# EasyEDA Pro project ProPrj_Плата захисту аккумулятора_2026-06-05.epro

# Schematic Schematic1
Board Name: Board1; Create Date: 2026-03-03; Page Name: P1; Project Name: Плата захисту аккумулятора; Schematic Name: Schematic1; Update Date: 2026-03-03; Company: EasyEDA.com; Page Size: A4; Version: V1.0
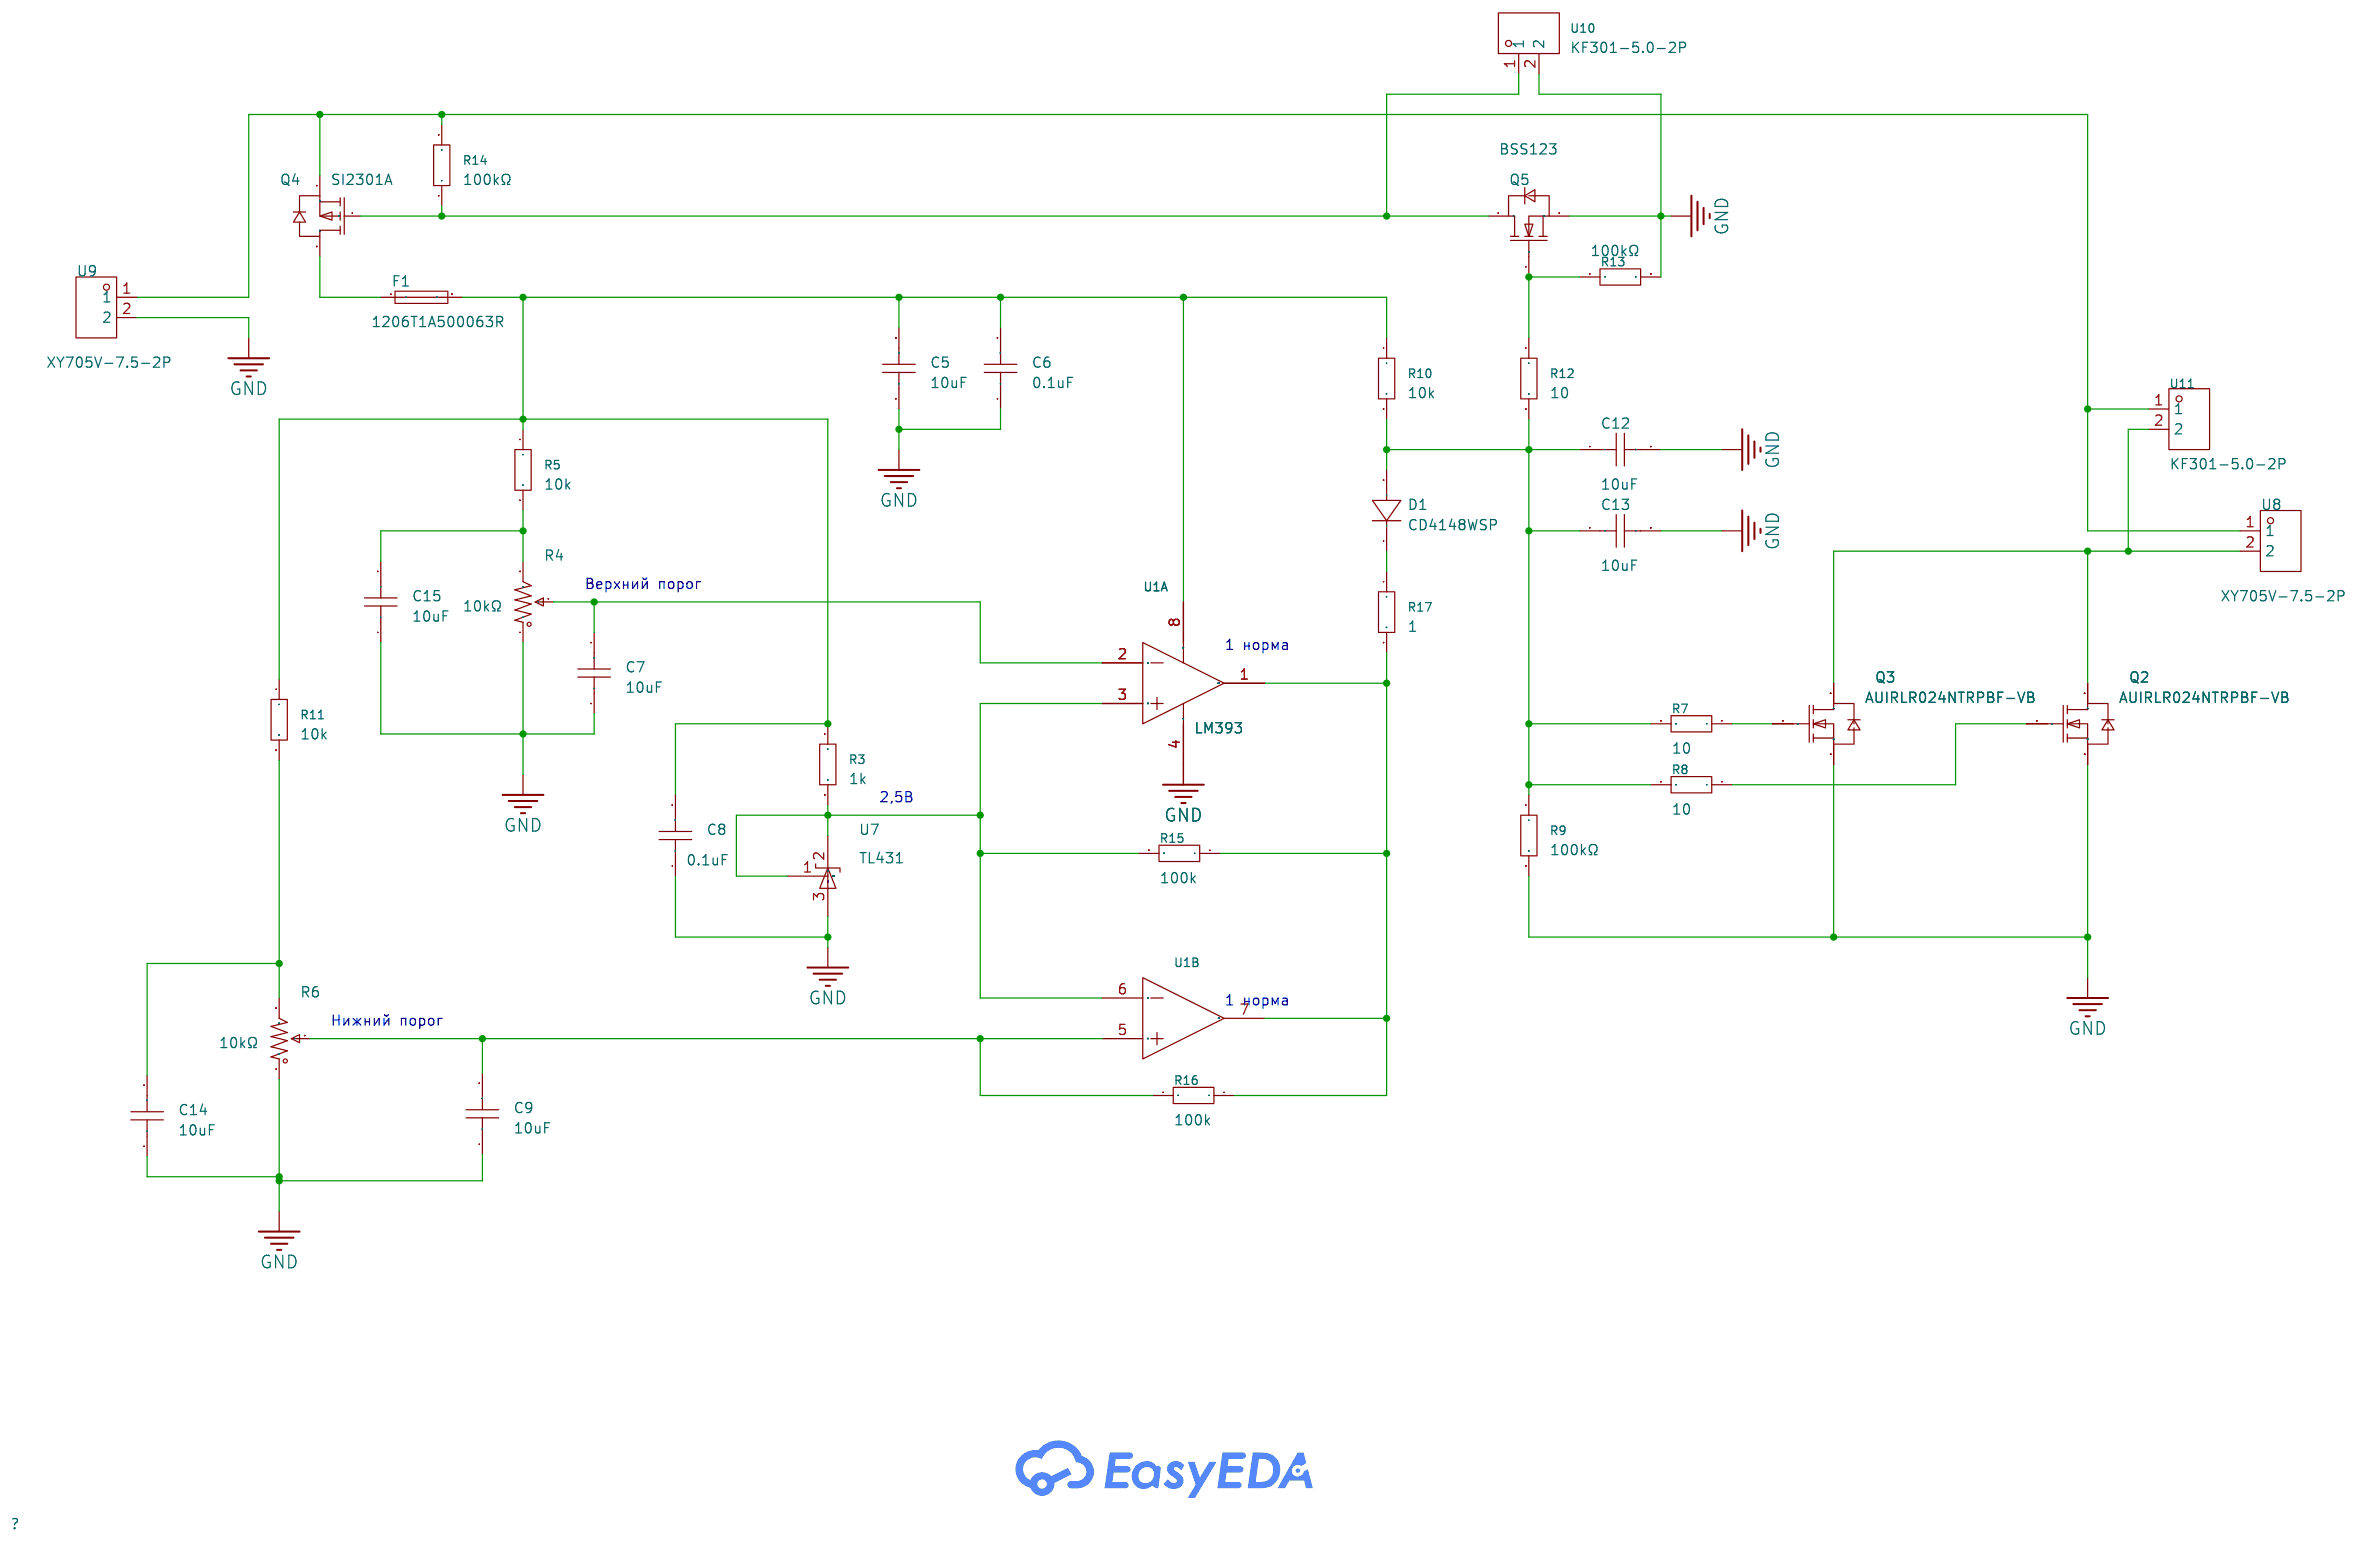
[diagram p0: schematic sheet]

## Parts
C5  10uF  [C1206]
C6  0.1uF  [C1206]
C7  10uF  [C1206]
C8  0.1uF  [C1206]
C9  10uF  [C1206]
C12  10uF  [C1206]
C13  10uF  [C1206]
C14  10uF  [C1206]
C15  10uF  [C1206]
D1  CD4148WSP  [D0805-RD]
F1  1206T1A500063R  [F1206]
Q2  AUIRLR024NTRPBF-VB  [TO-252-2_L6.5-W6.1-P4.56-LS9.9-BR-CW-1]
Q3  AUIRLR024NTRPBF-VB  [TO-252-2_L6.5-W6.1-P4.56-LS9.9-BR-CW-1]
Q4  SI2301A  [SOT-23-3_L2.9-W1.3-P1.90-LS2.4-BR]
Q5  BSS123  [SOT-23-3_L3.0-W1.7-P0.95-LS2.9-BR]
R3  1k  [R0805]
R4  10kΩ  [RES-ADJ-TH_3P-L10.0-W10.0-P2.50-L]
R5  10k  [R0805]
R6  10kΩ  [RES-ADJ-TH_3P-L10.0-W10.0-P2.50-L]
R7  10  [R0805]
R8  10  [R0805]
R9  100kΩ  [R0805]
R10  10k  [R0805]
R11  10k  [R0805]
R12  10  [R0805]
R13  100kΩ  [R0805]
R14  100kΩ  [R0805]
R15  100k  [R0805]
R16  100k  [R0805]
R17  1  [R0805]
U1  LM393  [SOP-8_L4.9-W3.9-P1.27-LS6.0-BL]  (sections 1,2)
U7  TL431  [SOT-23-3_L2.9-W1.3-P0.95-LS2.4-BR]
U8  XY705V-7.5-2P  [CONN-TH_XY705V-7.5-2P]
U9  XY705V-7.5-2P  [CONN-TH_XY705V-7.5-2P]
U10  KF301-5.0-2P  [CONN-TH_P5.00_KF301-5.0-2P]
U11  KF301-5.0-2P  [CONN-TH_P5.00_KF301-5.0-2P]

## Library data of the parts
C5-C9 C14 C15 = 1206B106K500NT: Capacitance:10uF Tolerance:±10% Tolerance:±10% Voltage Rating:50V Temperature Coefficient:X7R; LCSC Part Name: 10uF ±10% 50V; Supplier Part: C303950; Manufacturer: FH(风华); Supplier Footprint: 1206; JLCPCB Part Class: Extended Part; Datasheet: https://item.szlcsc.com/datasheet/1206B106K500NT/288017.html; Supplier: LCSC; Tolerance: ±10%; Voltage Rating: 50V; Temperature Coefficient: X7R
C12 C13 = C1206X106K025T: Capacitance: Tolerance:±10% Tolerance:±10% Voltage Rated: Temperature Coefficient:; LCSC Part Name: 10uF ±10% 25V; Supplier Part: C106027; Manufacturer: IHHEC(禾伸堂); Supplier Footprint: 1206; JLCPCB Part Class: Extended Part; Datasheet: https://atta.szlcsc.com/upload/public/pdf/source/20190313/C374174_331C86E4A68CC9C732DA87186AAF7F8A.pdf; Supplier: LCSC; Tolerance: ±10%
D1 = CD4148WSP_C30584799: Diode Configuration:Independent Voltage - Forward(Vf@If):1.25V@100mA Voltage - DC Reverse(Vr):75V Current - Rectified:150mA Pd - Power Dissipation:200mW Reverse Leakage Current (Ir):5uA@75V Reverse Recovery Time (trr):4ns Operating Junction Temperature Ra; LCSC Part Name: 75V 150mA; Supplier Part: C30584799; Manufacturer: YONGYUTAI(永裕泰); Supplier Footprint: 0805; JLCPCB Part Class: Extended Part; Datasheet: https://item.szlcsc.com/datasheet/CD4148WSP/32319011.html; Supplier: LCSC; Diode Configuration: Independent; Voltage - Forward(Vf@If): 1.25V@100mA; Voltage - DC Reverse(Vr): 75V; Current - Rectified: 150mA; Pd - Power Dissipation: 200mW; Reverse Leakage Current (Ir): 5uA@75V; Reverse Recovery Time (trr): 4ns; Operating Junction Temperature Range: -55℃~+150℃@(Tj); Non-Repetitive Peak Forward Surge Current: 1A
F1 = 1206T1A500063R: Type:Surface Mount Fuse Current Rating:1.5A Voltage Rating (DC):63V Operating Temperature:-55℃~+150℃ Operating Temperature:-55℃~+150℃ Melting I2t:0.583 Interrupt Rating:50A Length:3.2mm Width:1.6mm; LCSC Part Name: 贴片式陶瓷保险丝; Supplier Part: C354894; Manufacturer: WALTER(华德); Supplier Footprint: 1206; JLCPCB Part Class: Extended Part; Datasheet: https://item.szlcsc.com/datasheet/1206T1A500063R/330419.html; Supplier: LCSC; Type: Surface Mount Fuse; Current Rating: 1.5A; Voltage Rating (DC): 63V; Operating Temperature: -55℃~+150℃; Melting I2t: 0.583; Interrupt Rating: 50A; Length: 3.2mm; Width: 1.6mm
Q2 Q3 = AUIRLR024NTRPBF-VB: Number:1 N-Channel Drain to Source Voltage:60V Current - Continuous Drain(Id):18A RDS(on):73mΩ@10V Pd - Power Dissipation:- Gate Threshold Voltage (Vgs(th)):- Input Capacitance(Ciss):660pF@30V Reverse Transfer Capacitance (Crss@Vds):40pF@30V; LCSC Part Name: 1个N沟道 耐压:60V 电流:18A; Supplier Part: C7568984; Manufacturer: VBsemi(微碧半导体); Supplier Footprint: TO-252; JLCPCB Part Class: Extended Part; Datasheet: https://item.szlcsc.com/datasheet/AUIRLR024NTRPBF-VB/8683237.html; Supplier: LCSC; Number: 1 N-Channel; Drain to Source Voltage: 60V; Current - Continuous Drain(Id): 18A; RDS(on): 73mΩ@10V; Input Capacitance(Ciss): 660pF@30V; Reverse Transfer Capacitance (Crss@Vds): 40pF@30V
Q4 = SI2301A_C49010227: Drain to Source Voltage:20V Current - Continuous Drain(Id):2.5A RDS(on):85mΩ@4.5V Pd - Power Dissipation:700mW Gate Threshold Voltage (Vgs(th)):620mV@250uA Gate Charge(Qg):2.9nC@4.5V Input Capacitance(Ciss):248pF Reverse Transfer Capacitance (Crss@Vds):31; LCSC Part Name: 无 耐压:20V 电流:2.5A; Supplier Part: C49010227; Manufacturer: YONGYUTAI(永裕泰); Supplier Footprint: SOT-23; JLCPCB Part Class: Extended Part; Datasheet: https://item.szlcsc.com/datasheet/SI2301A/51366751.html; Supplier: LCSC; Drain to Source Voltage: 20V; Current - Continuous Drain(Id): 2.5A; RDS(on): 85mΩ@4.5V; Pd - Power Dissipation: 700mW; Gate Threshold Voltage (Vgs(th)): 620mV@250uA; Gate Charge(Qg): 2.9nC@4.5V; Input Capacitance(Ciss): 248pF; Reverse Transfer Capacitance (Crss@Vds): 31pF; Output Capacitance(Coss): 42pF
Q5 = BSS123_1: Number:1 N-channel Drain to Source Voltage:100V Current - Continuous Drain(Id):290mA RDS(on):2.7Ω@10V；2.95Ω@4.5V Pd - Power Dissipation:350mW Gate Threshold Voltage (Vgs(th)):1.8V Input Capacitance(Ciss):29pF Reverse Transfer Capacitance (Crss@Vds):2pF Op; LCSC Part Name: N沟道 耐压:100V 电流:290mA; Supplier Part: C39832210; Manufacturer: ElecSuper(静芯); Supplier Footprint: SOT-23; Datasheet: https://item.szlcsc.com/datasheet/BSS123/41557676.html; Supplier: LCSC; Number: 1 N-channel; Drain to Source Voltage: 100V; Current - Continuous Drain(Id): 290mA; RDS(on): 2.7Ω@10V；2.95Ω@4.5V; Pd - Power Dissipation: 350mW; Gate Threshold Voltage (Vgs(th)): 1.8V; Input Capacitance(Ciss): 29pF; Reverse Transfer Capacitance (Crss@Vds): 2pF; Operating Temperature: -55℃~+150℃; Type: N-Channel; Output Capacitance(Coss): 2.8pF
R3 R5 R7-R17 = RMC0805100K5%N: Type:Thick Film Resistor Resistance:100kΩ Tolerance:±5% Tolerance:±5% Power(Watts):125mW Voltage-Supply(Max):150V Temperature Coefficient:±100ppm/℃ Temperature Coefficient:±100ppm/℃ Operating Temperature:-55℃~+155℃ Operating Temperature:-55℃~+155℃; LCSC Part Name: 厚膜电阻 100kΩ ±5% 125mW; Supplier Part: C269722; Manufacturer: Tyohm(幸亚电阻); Supplier Footprint: 0805; JLCPCB Part Class: Extended Part; Datasheet: https://item.szlcsc.com/datasheet/RMC0805100K5%2525N/259162.html; Supplier: LCSC; Type: Thick Film Resistor; Tolerance: ±5%; Power(Watts): 125mW; Voltage-Supply(Max): 150V; Temperature Coefficient: ±100ppm/℃; Operating Temperature: -55℃~+155℃
R4 R6 = 3296W-1-103_C118954: Resistance:10kΩ Tolerance:±10% Tolerance:±10% Power(Watts):500mW Temperature Coefficient:±250ppm/℃ Temperature Coefficient:±250ppm/℃ Number of Turns:30; LCSC Part Name: 10kΩ ±10%; Supplier Part: C118954; Manufacturer: BOCHEN(博晨); Manufacturer Part: 3296W-1-103; Supplier Footprint: 插件-3P,9.5x4.9mm; JLCPCB Part Class: Extended Part; Datasheet: https://item.szlcsc.com/datasheet/3296W-1-103/120223.html; Supplier: LCSC; Tolerance: ±10%; Power(Watts): 500mW; Temperature Coefficient: ±250ppm/℃; Number of Turns: 30
U1 = LM393_C5252905: Number of Channels:2 Vos - Input Offset Voltage:1mV Ib - Input Bias Current:100nA Common Mode Rejection Ratio(CMRR):- Output Type:- Output Type:- Quiescent Current:600uA Operating Temperature:0℃~+70℃ Operating Temperature:0℃~+70℃; LCSC Part Name: 单电源电压范围:2V~32V LM393; Supplier Part: C5252905; Manufacturer: MSKSEMI(美森科); Supplier Footprint: SOP-8; JLCPCB Part Class: Extended Part; Datasheet: https://item.szlcsc.com/datasheet/LM393/5971206.html; Supplier: LCSC; Number of Channels: 2; Vos - Input Offset Voltage: 1mV; Ib - Input Bias Current: 100nA; Quiescent Current: 600uA; Operating Temperature: 0℃~+70℃
U7 = TL431_C49195703: Output Type:Adjustable Voltage - Supply:2.5V~40V Voltage - Supply:2.5V~40V Output Voltage:2.5V~40V Output Voltage:2.5V~40V Output Current:100mA Tolerance:±0.5% Tolerance:±0.5% Temperature Coefficient:50ppm/℃ Minimum Cathode Current for Regulation:50uA Ope; LCSC Part Name: 2.5V~40V 50ppm/℃; Supplier Part: C49195703; Manufacturer: KUU; Supplier Footprint: SOT-23; JLCPCB Part Class: Extended Part; Datasheet: https://item.szlcsc.com/datasheet/TL431/51597051.html; Supplier: LCSC; Output Type: Adjustable; Voltage - Supply: 2.5V~40V; Output Voltage: 2.5V~40V; Output Current: 100mA; Tolerance: ±0.5%; Temperature Coefficient: 50ppm/℃; Minimum Cathode Current for Regulation: 50uA; Operating Temperature: -40℃~+125℃
U8 U9 = XY705V-7.5-2P: Number of Positions or Pins:1x2P Pitch:7.5mm Color:Black Mounting Type:Through Hole Number of Pins:2P Number of Rows:1 Number of PINs Per Row:2 Screw Specification:M2.5 Current Rating:15A Voltage Rating (Max):300V Wire Gauge - AWG:14~22 Wire Gauge - mm2:2; LCSC Part Name: 1x2P 7.5mm 直插 排数:1 每排P数:2; Supplier Part: C557657; Manufacturer: XINLAIYA(新莱亚); Supplier Footprint: 插件,P=7.5mm; JLCPCB Part Class: Extended Part; Datasheet: https://item.szlcsc.com/datasheet/XY705V-7.5-2P/581020.html; Supplier: LCSC; Number of Positions or Pins: 1x2P; Pitch: 7.5mm; Color: Black; Mounting Type: Through Hole; Number of Pins: 2P; Number of Rows: 1; Number of PINs Per Row: 2; Screw Specification: M2.5; Current Rating: 15A; Voltage Rating (Max): 300V; Wire Gauge - AWG: 14~22; Wire Gauge - mm2: 2.5
U10 U11 = KF301-5.0-2P: Number of Positions or Pins:1x2P Pitch:5mm Color:Blue Mounting Type:Through Hole Number of Pins:2P Number of Rows:1 Number of PINs Per Row:2 Current Rating:17A Voltage Rating (Max):250V Wire Gauge - AWG:14~22 Wire Gauge - mm2:1.5 Wire Gauge - mm2:1.5 Oper; LCSC Part Name: 1x2P 5mm 直插 排数:1 每排P数:2; Supplier Part: C474881; Manufacturer: KEFA(科发); Supplier Footprint: 插件,P=5mm; JLCPCB Part Class: Extended Part; Datasheet: https://item.szlcsc.com/datasheet/KF301-5.0-2P/481499.html; Supplier: LCSC; Number of Positions or Pins: 1x2P; Pitch: 5mm; Color: Blue; Mounting Type: Through Hole; Number of Pins: 2P; Number of Rows: 1; Number of PINs Per Row: 2; Current Rating: 17A; Voltage Rating (Max): 250V; Wire Gauge - AWG: 14~22; Wire Gauge - mm2: 1.5; Operating Temperature: -30℃~+120℃

## Nets
GND: C5.1 C6.1 C7.1 C8.1 C9.1 C12.2 C13.2 C14.1 C15.1 Q2.3(S) Q3.3(S) Q5.2(S) R4.1 R6.1 R9.2 R13.2 U1.4(VEE) U7.3(ANODE) U9.2 U10.2
$1N2103: C15.2 R4.3 R5.2
$1N2162: C7.2 R4.2 U1.2(1IN-)
$1N2211: R3.2 R15.2 U1.3(1IN+) U1.6(2IN-) U7.1(REFERENCE) U7.2(CATHODE)
$1N2373: C9.2 R6.2 R16.2 U1.5(2IN+)
$1N2587: Q2.2(D) Q3.2(D) U8.2 U11.2
$1N2867: Q2.1(G) R8.1
$1N2876: Q3.1(G) R7.1
$1N3466: C14.2 R6.3 R11.2
$1N4334: F1.1 Q4.3(D)
$1N4367: Q4.2(S) R14.2 U8.1 U9.1 U11.1
$1N4444: Q4.1(G) Q5.3(D) R14.1 U10.1
$1N4584: Q5.1(G) R12.1 R13.1
$1N5209: C5.2 C6.2 C8.2 F1.2 R3.1 R5.1 R10.1 R11.1 U1.8(VCC)
$1N5413: C12.1 C13.1 D1.2(A) R7.2 R8.2 R9.1 R10.2 R12.2
$1N5775: D1.1(K) R17.1
$1N5785: R15.1 R16.1 R17.2 U1.1(1OUT1) U1.7(2OUT)

## Notes on the sheet
- Верхний порог
- 1 норма
- 2,5В
- 1 норма
- Нижний порог

# Board PCB1
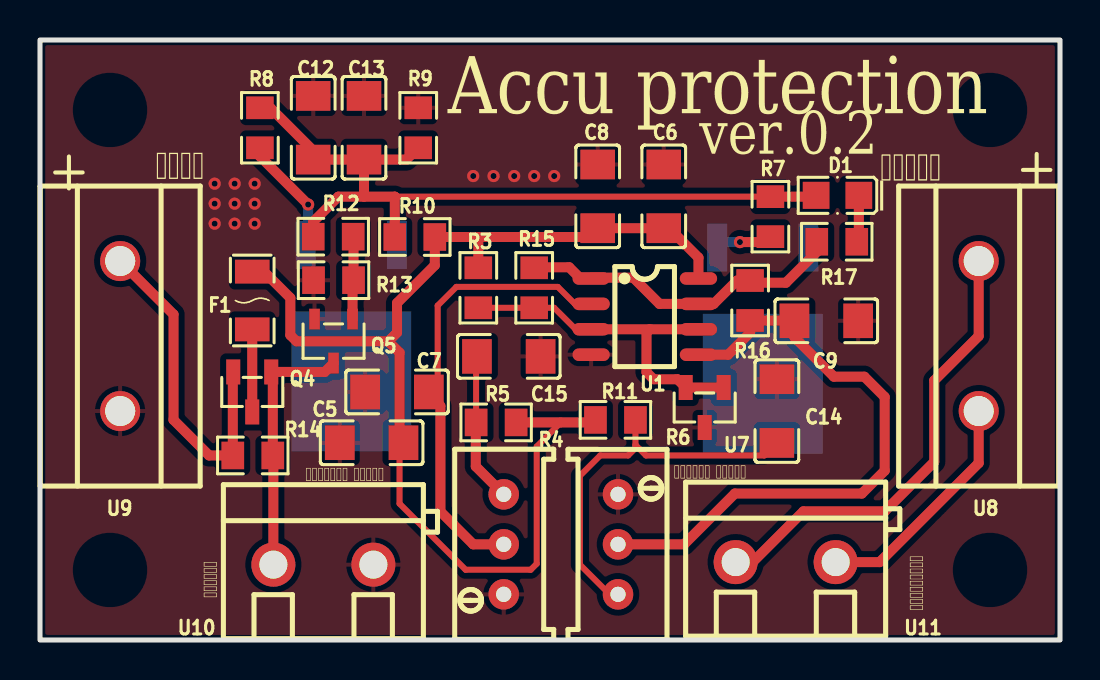
[diagram p1: board, top side]
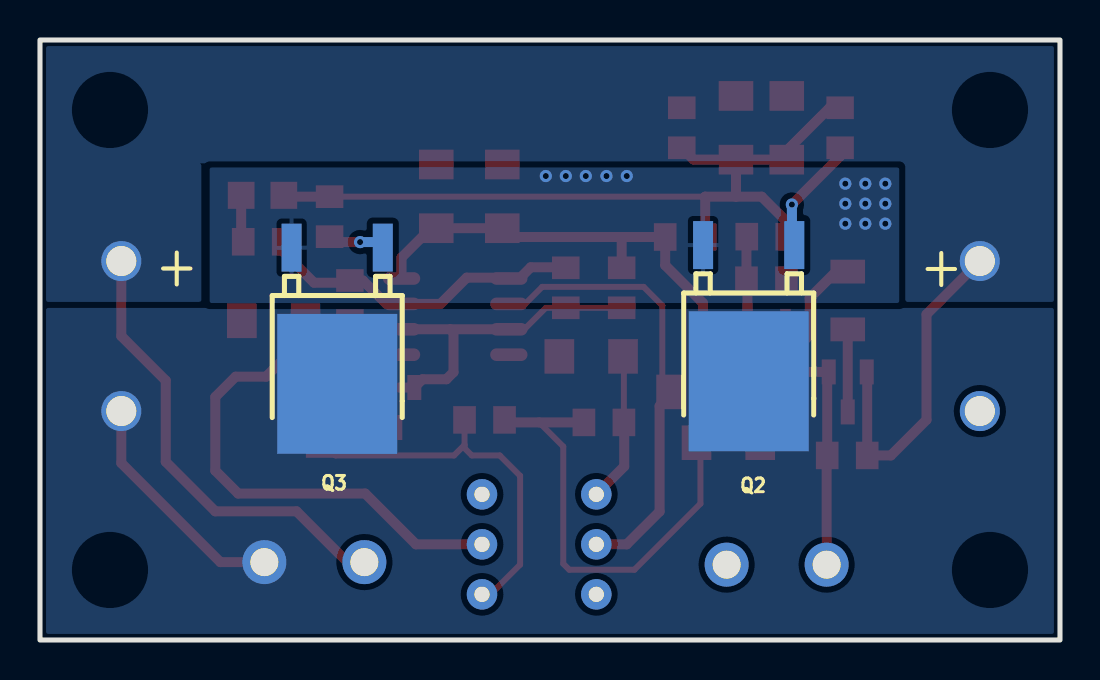
[diagram p2: board, bottom side, seen from below]

Outline 51 x 30 mm; copper layers: Top Layer, Bottom Layer. Coordinates in mm from the lower left corner of the outline.
Outline path: rectangle 0,30 51,0
Stack: Top Layer 0.035mm / Dielectric1 1.51mm FR4 er 4.5 / Bottom Layer 0.035mm

## Design rules (mm)
template: Custom Config
spacing copperThickness1oz (default): track to track 0.102, other pairs 0.152 to 0.3
spacing copperThickness2oz: track to track 0.203, other pairs 0.152 to 0.3
track width copperThickness1oz (default): min 0.127, default 0.254, max 2.54
track width copperThickness2oz: min 0.203, default 0.254, max 2.54
differential pair differentialPair (default): width min 0.127, default 0.254, max 2.54; gap min 0.152, default 0.152
via viaSize (default): diameter min 0.5, default 0.61, max 10; hole min 0.3, default 0.305, max 6.3
net GND uses copperRegion

## Placement (name value [footprint] x y rotation side)
C5  10uF  [C1206]  16.58 9.86 0 top
C6  0.1uF  [C1206]  31.19 22.18 270 top
C7  10uF  [C1206]  17.85 12.4 0 top
C8  0.1uF  [C1206]  27.88 22.18 270 top
C9  10uF  [C1206]  39.31 15.96 180 top
C12  10uF  [C1206]  13.66 25.61 90 top
C13  10uF  [C1206]  16.2 25.61 90 top
C14  10uF  [C1206]  36.84 11.45 270 top
C15  10uF  [C1206]  23.44 14.18 180 top
D1  CD4148WSP  [D0805-RD]  39.87 22.23 180 top
F1  1206T1A500063R  [F1206]  10.61 16.98 90 top
Q2  AUIRLR024NTRPBF-VB  [TO-252-2_L6.5-W6.1-P4.56-LS9.9-BR-CW-1]  15.56 16.34 90 bottom
Q3  AUIRLR024NTRPBF-VB  [TO-252-2_L6.5-W6.1-P4.56-LS9.9-BR-CW-1]  36.14 16.21 90 bottom
Q4  SI2301A  [SOT-23-3_L2.9-W1.3-P1.90-LS2.4-BR]  10.61 12.4 90 top
Q5  BSS123  [SOT-23-3_L3.0-W1.7-P0.95-LS2.9-BR]  14.68 14.94 90 top
R3  1k  [R0805]  21.91 17.61 270 top
R4  10kΩ  [RES-ADJ-TH_3P-L10.0-W10.0-P2.50-L]  23.19 4.78 90 top
R5  10k  [R0805]  22.8 10.88 180 top
R6  10kΩ  [RES-ADJ-TH_3P-L10.0-W10.0-P2.50-L]  28.9 4.78 270 top
R7  10  [R0805]  36.52 21.17 90 top
R8  10  [R0805]  10.99 25.61 90 top
R9  100kΩ  [R0805]  18.91 25.61 90 top
R10  10k  [R0805]  18.74 20.15 180 top
R11  10k  [R0805]  28.77 11.01 0 top
R12  10  [R0805]  14.66 20.17 180 top
R13  100kΩ  [R0805]  14.68 17.99 180 top
R14  100kΩ  [R0805]  10.64 9.23 180 top
R15  100k  [R0805]  24.71 17.61 270 top
R16  100k  [R0805]  35.5 16.98 270 top
R17  1  [R0805]  39.84 19.91 180 top
U1  LM393  [SOP-8_L4.9-W3.9-P1.27-LS6.0-BL]  30.24 16.17 270 top
U7  TL431  [SOT-23-3_L2.9-W1.3-P0.95-LS2.4-BR]  33.23 11.62 90 top
U8  XY705V-7.5-2P  [CONN-TH_XY705V-7.5-2P]  46.93 15.2 270 top
U9  XY705V-7.5-2P  [CONN-TH_XY705V-7.5-2P]  4.01 15.2 270 top
U10  KF301-5.0-2P  [CONN-TH_P5.00_KF301-5.0-2P]  14.17 3.77 0 top
U11  KF301-5.0-2P  [CONN-TH_P5.00_KF301-5.0-2P]  37.28 3.89 0 top

## Footprints (pads in the part's own frame, mm; a bottom-side part is the same pattern mirrored in y, then rotated)
C1206
  rect 1.485x1.728 smd: 1(-1.593,0) 2(1.593,0)
CONN-TH_P5.00_KF301-5.0-2P
  round 2.2 hole 1.4: 1(-2.5,0) 2(2.5,0)
CONN-TH_XY705V-7.5-2P
  round 2 hole 1.5: 1(-3.75,0) 2(3.75,0)
D0805-RD
  rect 1.335x1.35 smd: 1(-1.067,0) 2(1.067,0)
F1206
  rect 1.19x1.728 smd: 1(-1.445,0) 2(1.445,0)
R0805
  rect 1.133x1.377 smd: 1(-1,0) 2(1,0)
RES-ADJ-TH_3P-L10.0-W10.0-P2.50-L
  round 1.524 hole 0.762: 1(-2.5,0) 2(0,0) 3(2.5,0)
SOP-8_L4.9-W3.9-P1.27-LS6.0-BL
  oval 0.63x1.865 smd: 1(-1.905,-2.683) 2(-0.635,-2.683) 3(0.635,-2.683) 4(1.905,-2.683) 5(1.905,2.683) 6(0.635,2.683) 7(-0.635,2.683) 8(-1.905,2.683)
SOT-23-3_L2.9-W1.3-P0.95-LS2.4-BR
  rect 1.25x0.7 smd: 1(1,-0.95) 2(1,0.95) 3(-1,0)
SOT-23-3_L2.9-W1.3-P1.90-LS2.4-BR
  rect 1.25x0.7 smd: 1(1,-0.95) 2(1,0.95) 3(-1,0)
SOT-23-3_L3.0-W1.7-P0.95-LS2.9-BR
  rect 1.038x0.532 smd: 1(1.101,-0.95) 2(1.101,0.95) 3(-1.101,0)
TO-252-2_L6.5-W6.1-P4.56-LS9.9-BR-CW-1
  rect 2.4x1 smd: 1(3.405,-2.28) 3(3.405,2.28)
  rect 7x6 smd: 2(-3.405,0)

## Nets
As in the schematic.

## Via types
v1: diameter 0.61, hole 0.305, Top Layer to Bottom Layer, 16 vias

## Routing (per net, layer and track width the routed paths; a pad name or vN(x,y) marks a point on that pad's centre or on a via; arc(x,y) is an arc through that point)
GND: length 0.1
  Top Layer w0.5: 13.73,17.69 13.68,17.74
  vias: v1(8.73,22.82) v1(8.73,21.82) v1(8.73,20.82) v1(9.73,22.82) v1(9.73,21.82) v1(9.73,20.82) v1(10.73,22.82) v1(10.73,21.82) v1(10.73,20.82) v1(21.66,23.2) v1(22.68,23.2) v1(23.71,23.2) v1(24.71,23.2) v1(25.71,23.2)
$1N2103: length 7.5
  Top Layer w0.299: C15.2 21.8,14.14 R5.2
  Top Layer w0.5: R4.3 21.79,8.68 21.79,10.86 R5.2
$1N2162: length 22.9
  Top Layer w0.299: C7.2 19.88,12.84 19.88,16.72 20.82,17.66 25.89,17.66 26.74,16.81 U1.2
  Top Layer w0.5: R4.2 21.66,4.78 20.02,6.42 20.02,11.7 19.44,12.28 19.51,12.34
$1N2211: length 17.8
  Top Layer w0.299: 28.25,15.54 U1.3 26.78,15.54 25.71,16.61 R15.2 R3.2
  Top Layer w0.5: 30.49,15.54 30.32,15.37 30.32,13.39 30.68,13.04 31.87,13.04 U7.2 U7.1 ; 30.49,15.54 28.25,15.54 ; 30.49,15.54 U1.6
$1N2373: length 31
  Top Layer w0.5: U1.5 34.4,14.27 35.5,15.37 R16.2 37.71,15.98 C9.2 37.72,15.14 39.69,13.17 41.22,13.17 42.24,12.15 42.24,8.47 41.09,7.32 34.74,7.32 32.2,4.78 R6.2
$1N2587: length 11.8
  Top Layer w0.5: U8.2 46.93,8.85 41.98,3.89 U11.2
$1N2867: length 5.9
  Top Layer w0.5: R8.1 10.99,24.19 v1(13.41,21.77)
  Bottom Layer w0.5: v1(13.41,21.77) 13.41,19.87 Q2.1
$1N2876: length 2.9
  Top Layer w0.5: v1(35,19.9) 36.25,19.9 R7.1
  Bottom Layer w0.5: v1(35,19.9) 34.14,19.9 Q3.1
$1N3466: length 19.3
  Top Layer w0.299: R11.2 29.77,9.75 ; 29.77,9.75 29.77,9.59 29.41,9.23 28.01,9.23 27,8.21 27,3.77 28.48,2.28 R6.3 ; 29.77,9.75 30.3,9.23 36.22,9.23 C14.2
$1N4334: length 4.1
  Top Layer w0.5: 10.61,15.53 Q4.3
$1N4367: length 39.9
  Top Layer w0.5: Q4.2 9.64,13.38 R14.2 8.45,9.23 6.68,11.01 6.68,16.28 U9.1 ; U11.1 35.63,3.89 38.17,6.43 42.24,6.43 44.71,8.91 44.71,12.97 46.93,15.2 U8.1
$1N4444: length 13
  Top Layer w0.5: U10.1 11.67,9.2 R14.1 11.64,13.33 Q4.1 14.24,13.4 Q5.3
$1N4584: length 4.1
  Top Layer w0.5: Q5.1 15.63,17.69 15.68,17.74 15.68,20.15 R12.1
$1N5209: length 60.7
  Top Layer w0.299: 17.98,10.06 17.98,6.82 21.28,3.51 24.54,3.51 24.84,3.81 24.84,9.67 26.04,10.88 ; 11.2,18.42 F1.2
  Top Layer w0.5: 17.41,14.93 17.98,14.37 17.98,10.06 C5.2 ; 17.41,14.93 17.85,15.37 17.85,16.85 19.74,18.74 R10.1 21.96,20.15 ; 17.41,14.93 12.83,14.93 12.52,15.24 12.52,17.1 11.2,18.42 ; 21.96,20.15 21.91,20.11 R3.1 ; 21.96,20.15 27.44,20.15 C8.2 C6.2 31.45,20.59 32.92,19.12 U1.8 ; R5.1 27.65,10.88 R11.1
$1N5413: length 39.8
  Top Layer w0.3: R7.2 17.74,22.17
  Top Layer w0.5: R8.2 11.52,26.61 13.66,24.47 C12.1 C13.1 ; C13.1 16.2,22.17 ; C13.1 18.32,24.02 R9.1 ; 16.2,22.17 17.74,22.17 17.74,22.16 R10.2 ; 16.2,22.17 14.91,22.17 13.66,20.91 R12.2 ; R7.2 38.74,22.17 D1.2
$1N5775: length 2.4
  Top Layer w0.5: D1.1 40.94,20.02 R17.1
$1N5785: length 16.4
  Top Layer w0.5: 35.62,17.86 35.63,17.86 37.3,17.86 38.84,19.4 R17.2 ; R16.1 34.85,17.98 33.68,16.81 U1.7 30.97,16.81 29.66,18.12 27.6,18.12 U1.1 27.02,18.08 26.46,18.64 24.74,18.64 R15.1

## Copper pours and planes (outline as drawn; the poured copper is in the pictures)
GND on Top Layer: 0.04,30.06 51.09,30.06 51.09,0.08 0.04,0.08
GND on Bottom Layer: 8.04,23.63 42.52,23.63 42.52,16.85 8.04,16.85
$1N2587 on Bottom Layer: 0.04,16.6 51.09,16.6 51.09,-0.07 0.04,-0.07
$1N4367 on Bottom Layer: 0.01,16.82 0.01,29.87 0.07,29.93 51,29.93 50.93,29.86 50.93,16.85 42.93,16.85 42.93,23.77 43,23.83 7.82,23.83 7.82,16.85 7.79,16.82

## Text on the board
Bottom Silkscreen Layer: +
Top Silkscreen Layer: + | Вхід | Вихід | ver.0.2 | Accu protection | Верхній поріг | нижній поріг | Кнопка | Вольтметр
